# Altium schematic sheet schematic.SchDoc
size A4
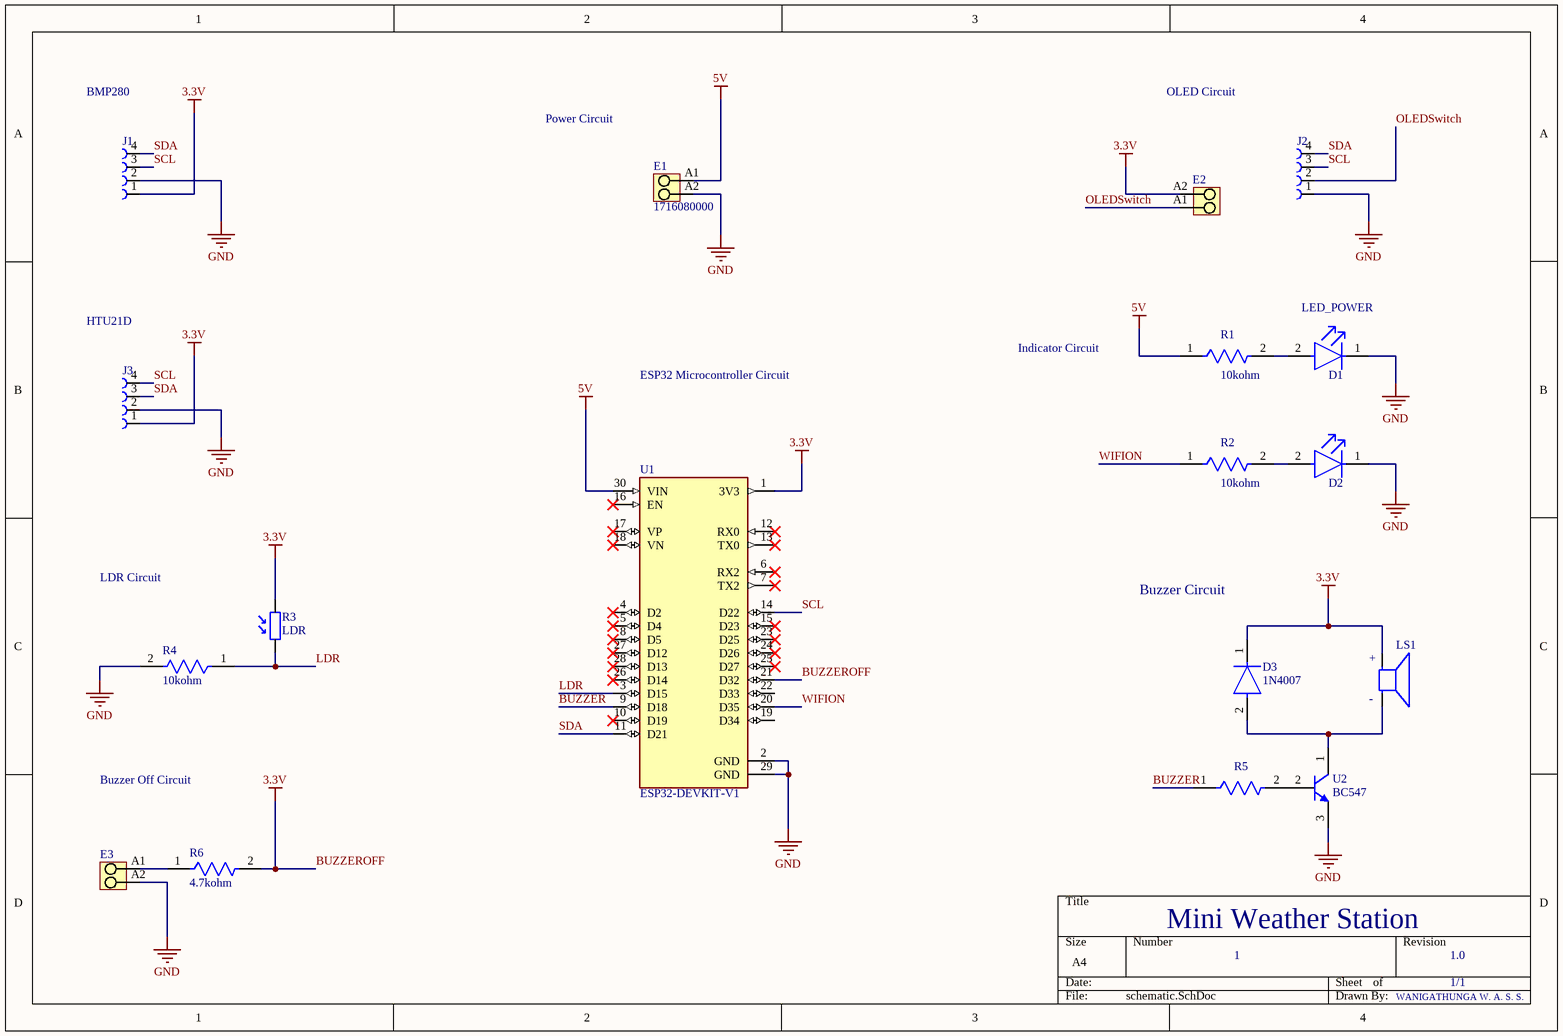
[diagram p0: schematic.SchDoc]

## Parts
D1  LED_POWER  [FP-HLMP-4700-MFG]
D2  HLMP-4700  [FP-HLMP-4700-MFG]  (value not drawn)
D3  1N4007  [FP-1N4007-MFG]
E1  1716080000  [LM_5_08_90_02]
E2  1716080000  [LM_5_08_90_02]  (value not drawn)
E3  1716080000  [LM_5_08_90_02]  (value not drawn)
J1  61300411121  [61300411121]  (value not drawn)
J2  61300411121  [61300411121]  (value not drawn)
J3  61300411121  [61300411121]  (value not drawn)
LS1  AI-1223-TWT-5V-R  [XDCR_AI-1223-TWT-5V-R]  (value not drawn)
R1  10kohm  [FP-CFR-25-MFG]
R2  10kohm  [FP-CFR-25-MFG]
R3  LDR  [NSL_19M51]
R4  10kohm  [FP-CFR-25-MFG]
R5  CFR-25JB-52-10R  [FP-CFR-25-MFG]  (value not drawn)
R6  4.7kohm  [FP-CFR-25-MFG]
U1  ESP32-DEVKIT-V1  [MODULE_ESP32_DEVKIT_V1]
U2  BC547  [ONSC-TO-92-3-29-11_AM_BL]

## Nets
5V: E1.A1 R1.1 U1.30(VIN)
BUZZEROFF: D3.1(C) E2.A2 J1.1 J3.1 LS1.P(POS) R3.2 R6.2 U1.1(3V3) U1.21(D32)  [also labelled 3.3V]
GND: D1.1(C) D2.1(C) E1.A2 E3.A2 J1.2 J2.1 J3.2 R4.2 U1.2(GND) U1.29(GND) U2.3(E)
BUZZER: R5.1 U1.9(D18)
LDR: R3.1 R4.1 U1.3(D15)
OLEDSwitch: E2.A1 J2.2
SCL: J1.3 J2.3 J3.4 U1.14(D22)
SDA: J1.4 J2.4 J3.3 U1.11(D21)
WIFION: R2.1 U1.20(D35)
NetD1_2: D1.2(A) R1.2
NetD2_2: D2.2(A) R2.2
NetD3_2: D3.2(A) LS1.N(NEG) U2.1(C)
NetE3_A1: E3.A1 R6.1
NetR5_2: R5.2 U2.2(B)

Not connected (* = marked no-connect by the designer): U1 4(D2)* 5(D4)* 6(RX2)* 7(TX2)* 8(D5)* 10(D19)* 12(RX0)* 13(TX0)* 15(D23)* 16(EN)* 17(VP)* 18(VN)* 19(D34) 22(D33) 23(D25)* 24(D26)* 25(D27)* 26(D14)* 27(D12)* 28(D13)*

## Notes on the sheet
- BMP280
- OLED Circuit
- Power Circuit
- HTU21D
- ESP32 Microcontroller Circuit
- Indicator Circuit
- LDR Circuit
- Buzzer Circuit
- Buzzer Off Circuit
- Mini Weather Station
- 1
- 1.0
- 1/1
- WANIGATHUNGA W. A. S. S.
- (in symbol AI-1223-TWT-5V-R) +; -

## Library data of the parts
D1 D2 = CMP-18399-000008-1: LED RED DIFFUSED T-1 3/4 T/H; Manufacturer: Broadcom; Luminous Intensity: 2.3mcd; Peak Emmision Wavelength: 635nm; Forward Voltage: 1.7V; Viewing Angle: 50°; Led Orientation: Straight; Reverse Voltage: 5V; Forward Current: 2mA; Power Dissipation: 14mW; Wavelength: 626nm; Digikey Description: LED RED DIFFUSED T-1 3/4 T/H; Device Class L3: unset; Temperature Range Low: -40°C; Temperature Range High: +100°C; RoHS: TRUE; Package: HLMP-4700; Octopart: https://octopart.com/hlmp-4700-broadcom-71130526; Automotive: No; ComponentLink2URL: https://docs.broadcom.com/docs/AV02-1557EN; Colour: Red; Temperature: -40°C to +100°C; Lead Free: Yes; Category: Diode; ComponentLink2Description: Datasheet; Manufacturer Part Number: HLMP-4700; Device Class L1: Optoelectronics; Device Class L2: LEDs; Mouser Description: LED; Red; 2.3mcd; 0.24In.Dia.; T-1-3/4; 500mA; 1.7V; 635nm; 50deg; 5V; 24mW; -55degC;
D3 = CMP-02540-000046-1: DIODE GEN PURP 1KV 1A DO204AL; Manufacturer: Vishay; Manufacturer Part Number: 1N4007-E3/54; Value: 15pF; Max Junction Temp: +150°C; Max Surge Forward Current: 30A; Max Repetitive Reverse Voltage: 1000V; Peak Reverse Current: 30uA; Octopart: https://octopart.com/1n4007-e3%2F54-vishay-39548207; Digikey Description: DIODE GEN PURP 1KV 1A DO204AL; Category: Diode; Mouser Description: Rectifiers Vr/1000V Io/1A; Automotive: No; Package: 1N4007; Device Class L3: Rectifier Diodes; Temperature Range High: +150°C; Capacitance: 15pF; Ipc Land Pattern Name: DIOPA1088W105L520D270; Lead Free: Yes; ComponentLink2Description: Datasheet; Forward Current: 1A; Device Class L1: Discrete Semiconductors; ComponentLink2URL: http://www.vishay.com/docs/88503/1n4001.pdf; Temperature Range Low: -50°C; Height: 2.7mm; RoHS: TRUE; Temperature: -50°C to +150°C; Device Class L2: Diodes
E1-E3 = CMP-1559-01766-1: OMNIMATE Signal - series LM; Manufacturer: Weidmueller; Solder_pin_length_mm: 3,5 mm; Solid_max_H05_07_V_U: 2,5 mm²; Contact_material: Cu-Leg; No_of_poles: 2; Mounting_onto_the_PCB: Solder connection; Contact_surface: tinned; Wire_cross_section_AWG_max_UL_1059: AWG 14; Rated_voltage_for_surge_voltage_class_pollution_degree_II_2: 630 V; Side_termination_characteristic: closed side; UL_94_flammability_rating: V-0; Wire_cross_section_AWG_min_UL_1059: AWG 24; Pitch_mm: 5,08 mm; Pitch_inch: 0,2 inch; Rated_voltage_use_group_B_UL_1059: 300 V; Solid_min_H05_07_V_U: 0,2 mm²; Short_text_for_material: LM 5.08/02/90 3.5SN OR BX; Insulating_material: Wemid (PA); Rated_current_use_group_B_UL_1059: 15 A; PartNumber: 1716080000; Colour: Orange; ComponentLink1URL: http://www.weidmueller.com/; ComponentLink1Description: Manufacturer URL; Revision: V1; Qty: 500 PCS; ComponentLink2Description: URL Link1; ComponentLink2URL: http://catalog.weidmueller.com/catalog/Start.do?localeId=en&ObjectID=1716080000; Packaging: Box; PackageReference: LM_5_08_90_02
J1-J3 = 61300411121: Connector Header Through Hole 4 position 0.100 (2.54mm); MF: WÃ¼rth Elektronik; Purchase-URL: https://pricing.snapeda.com/search/part/61300411121/?ref=eda; SnapEDA_Link: https://www.snapeda.com/parts/61300411121/Wurth+Elektronik/view-part/?ref=snap; MP: 61300411121; Package: None; Check_prices: https://www.snapeda.com/parts/61300411121/Wurth+Elektronik/view-part/?ref=eda; Price: None; Availability: In Stock; Value: *
LS1 = AI-1223-TWT-5V-R: ELECTRO MECHANICAL AUDIO INDICATOR; MF: PUI Audio,; Price: None; Availability: In Stock; MP: AI-1223-TWT-5V-R; Package: 2225 PUI Audio; SnapEDA_Link: https://www.snapeda.com/parts/AI-1223-TWT-5V-R/PUI+Audio%252C+Inc./view-part/?ref=snap; Check_prices: https://www.snapeda.com/parts/AI-1223-TWT-5V-R/PUI+Audio%252C+Inc./view-part/?ref=eda; Value: *; Purchase-URL: https://pricing.snapeda.com/search/part/AI-1223-TWT-5V-R/?ref=eda
R1 R2 R4-R6 = CMP-03413-000009-1: RES 10 OHM 1/4W 5% AXIAL; Resistance: 10R; Temperature Coefficient: 500ppm/°C; Max Power Dissipation: 250mW; RoHS Compliant: Yes; Packaging: Bulk; Series: Carbon Film; Case/Package: Axial; Max Operating Temperature: 155°C; Min Operating Temperature: -55°C; Number of Terminations: 2; Length: 0.248inch; Resistor Type: Carbon Film; Tolerance: 5%; Package Quantity: 200
R3 = NSL-19M51: CdS Cells 550nm 20 ~ 100kOhms @ 10 lux; MF: Advanced Photonix; MP: NSL-19M51; Value: *; SnapEDA_Link: https://www.snapeda.com/parts/NSL-19M51/Advanced%20Photonix/view-part/616752/?ref=snap; Price: None; Package: TO-18 Luna Optoelectronics; Availability: Unavailable
U1 = ESP32-DEVKIT-V1: Dual core, Wi-Fi: 2.4 GHz up to 150 Mbits/s,BLE (Bluetooth Low Energy) and legacy Bluetooth, 32 bits, Up to 240 MHz; MF: Do it; Price: None; Availability: Not in stock; Package: None; MP: ESP32-DEVKIT-V1; Value: *; SnapEDA_Link: https://www.snapeda.com/parts/ESP32-DEVKIT-V1/Do+it/view-part/?ref=snap; Check_prices: https://www.snapeda.com/parts/ESP32-DEVKIT-V1/Do+it/view-part/?ref=eda
U2 = CMP-1048-01605-1: Amplifier Transistor, NPN Silicon, 3-Pin TO-92, Pb-Free, Tape and Reel; Manufacturer: On Semiconductor; PartNumber: BC547BRL1G; IC Continuous (A): 0.1; fT Min (MHz): 150; ComponentLink2URL: http://www.onsemi.com/pub_link/Collateral/BC546-D.PDF; ComponentLink1URL: http://www.onsemi.com/; ComponentLink2Description: Datasheet; RoHS: TRUE; ComponentLink3Description: Package Specification; ComponentLink1Description: Manufacturer URL; ComponentLink3URL: http://www.onsemi.com/pub_link/Collateral/MAC97-D.PDF; PackageDescription: 3-Pin Transistor Outline, Body 4.825 x 3.685 mm, Pitch 1.27 mm; Packing: Tape and Reel; PackageVersion: Rev. AM; Polarity: NPN; DatasheetVersion: Rev. 7; Mounting Technology: Through Hole; PackageReference: TO-92-3-29-11_AM_BL